# Altium schematic sheet MAIN.SchDoc
size A3; SheetNumber: 1; SheetTotal: 1
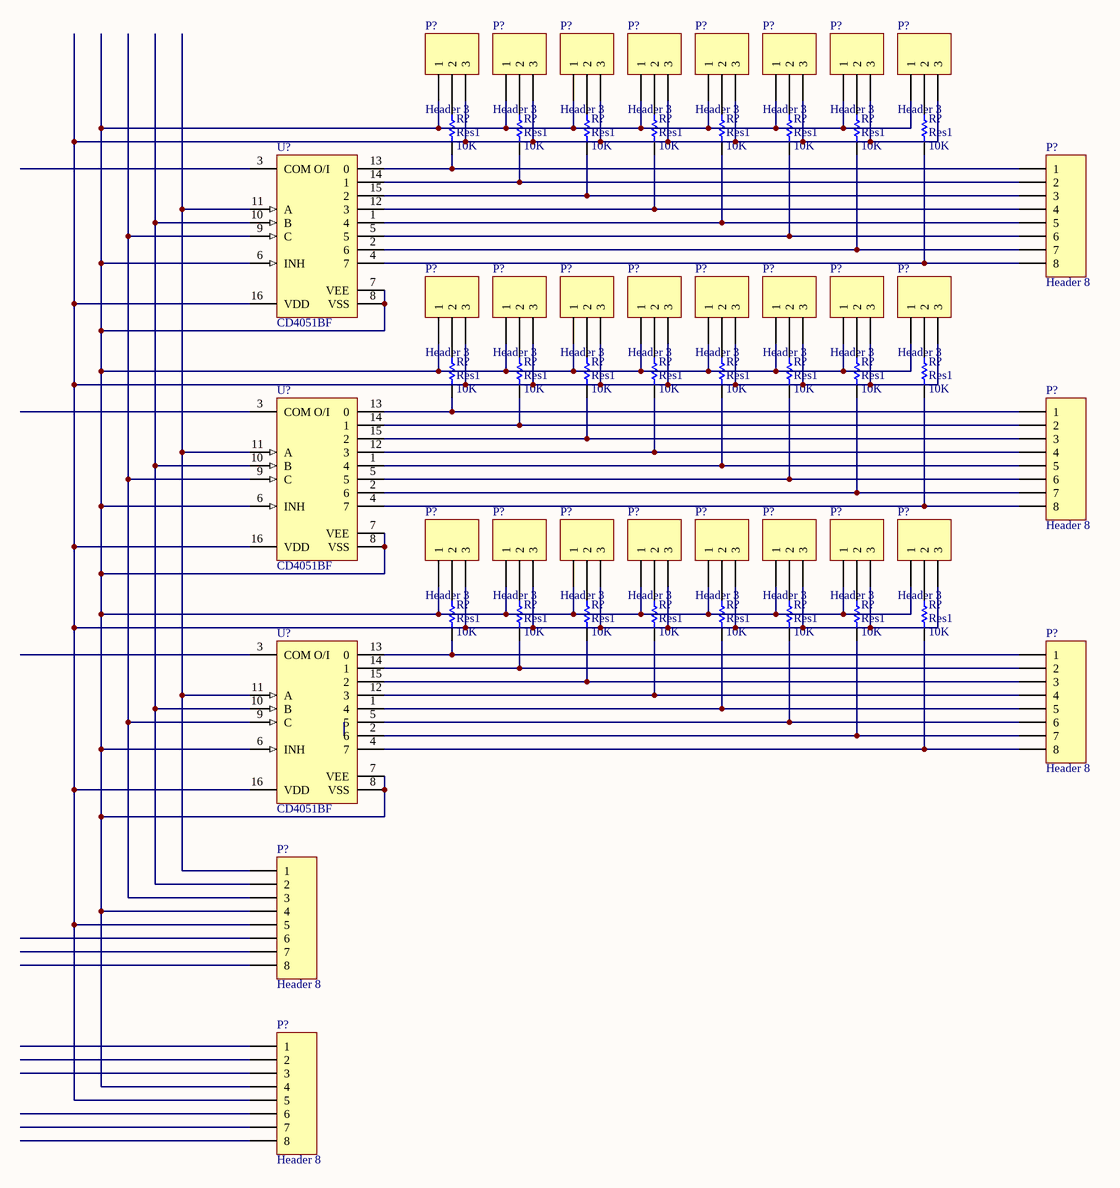
[diagram p0: MAIN.SchDoc]

## Parts
(Parts that share a designator on the sheet are numbered #1, #2 ... from top to bottom, then left to right.)
P?#1  Header 3  [HDR1X3]
P?#2  Header 3  [HDR1X3]
P?#3  Header 3  [HDR1X3]
P?#4  Header 3  [HDR1X3]
P?#5  Header 3  [HDR1X3]
P?#6  Header 3  [HDR1X3]
P?#7  Header 3  [HDR1X3]
P?#8  Header 3  [HDR1X3]
P?#9  Header 8  [HDR1X8]
P?#10  Header 3  [HDR1X3]
P?#11  Header 3  [HDR1X3]
P?#12  Header 3  [HDR1X3]
P?#13  Header 3  [HDR1X3]
P?#14  Header 3  [HDR1X3]
P?#15  Header 3  [HDR1X3]
P?#16  Header 3  [HDR1X3]
P?#17  Header 3  [HDR1X3]
P?#18  Header 8  [HDR1X8]
P?#19  Header 3  [HDR1X3]
P?#20  Header 3  [HDR1X3]
P?#21  Header 3  [HDR1X3]
P?#22  Header 3  [HDR1X3]
P?#23  Header 3  [HDR1X3]
P?#24  Header 3  [HDR1X3]
P?#25  Header 3  [HDR1X3]
P?#26  Header 3  [HDR1X3]
P?#27  Header 8  [HDR1X8]
P?#28  Header 8  [HDR1X8]
P?#29  Header 8  [HDR1X8]
R?#1  Res1  value 10K  [AXIAL-0.3]
R?#2  Res1  value 10K  [AXIAL-0.3]
R?#3  Res1  value 10K  [AXIAL-0.3]
R?#4  Res1  value 10K  [AXIAL-0.3]
R?#5  Res1  value 10K  [AXIAL-0.3]
R?#6  Res1  value 10K  [AXIAL-0.3]
R?#7  Res1  value 10K  [AXIAL-0.3]
R?#8  Res1  value 10K  [AXIAL-0.3]
R?#9  Res1  value 10K  [AXIAL-0.3]
R?#10  Res1  value 10K  [AXIAL-0.3]
R?#11  Res1  value 10K  [AXIAL-0.3]
R?#12  Res1  value 10K  [AXIAL-0.3]
R?#13  Res1  value 10K  [AXIAL-0.3]
R?#14  Res1  value 10K  [AXIAL-0.3]
R?#15  Res1  value 10K  [AXIAL-0.3]
R?#16  Res1  value 10K  [AXIAL-0.3]
R?#17  Res1  value 10K  [AXIAL-0.3]
R?#18  Res1  value 10K  [AXIAL-0.3]
R?#19  Res1  value 10K  [AXIAL-0.3]
R?#20  Res1  value 10K  [AXIAL-0.3]
R?#21  Res1  value 10K  [AXIAL-0.3]
R?#22  Res1  value 10K  [AXIAL-0.3]
R?#23  Res1  value 10K  [AXIAL-0.3]
R?#24  Res1  value 10K  [AXIAL-0.3]
U?#1  CD4051BF  [J0016A]
U?#2  CD4051BF  [J0016A]
U?#3  CD4051BF  [J0016A]

## Nets
NetP?#1_1: P?#1.1 P?#2.1 P?#3.1 P?#4.1 P?#5.1 P?#6.1 P?#7.1 P?#8.1 P?#10.1 P?#11.1 P?#12.1 P?#13.1 P?#14.1 P?#15.1 P?#16.1 P?#17.1 P?#19.1 P?#20.1 P?#21.1 P?#22.1 P?#23.1 P?#24.1 P?#25.1 P?#26.1 P?#28.4 P?#29.4 U?#1.6(INH) U?#1.7(VEE) U?#1.8(VSS) U?#2.6(INH) U?#2.7(VEE) U?#2.8(VSS) U?#3.6(INH) U?#3.7(VEE) U?#3.8(VSS)
NetP?#1_2: P?#1.2 R?#1.2
NetP?#1_3: P?#1.3 P?#2.3 P?#3.3 P?#4.3 P?#5.3 P?#6.3 P?#7.3 P?#8.3 P?#10.3 P?#11.3 P?#12.3 P?#13.3 P?#14.3 P?#15.3 P?#16.3 P?#17.3 P?#19.3 P?#20.3 P?#21.3 P?#22.3 P?#23.3 P?#24.3 P?#25.3 P?#26.3 P?#28.5 P?#29.5 U?#1.16(VDD) U?#2.16(VDD) U?#3.16(VDD)
NetP?#2_2: P?#2.2 R?#2.2
NetP?#3_2: P?#3.2 R?#3.2
NetP?#4_2: P?#4.2 R?#4.2
NetP?#5_2: P?#5.2 R?#5.2
NetP?#6_2: P?#6.2 R?#6.2
NetP?#7_2: P?#7.2 R?#7.2
NetP?#8_2: P?#8.2 R?#8.2
NetP?#9_1: P?#9.1 R?#1.1 U?#1.13(0)
NetP?#9_2: P?#9.2 R?#2.1 U?#1.14(1)
NetP?#9_3: P?#9.3 R?#3.1 U?#1.15(2)
NetP?#9_4: P?#9.4 R?#4.1 U?#1.12(3)
NetP?#9_5: P?#9.5 R?#5.1 U?#1.1(4)
NetP?#9_6: P?#9.6 R?#6.1 U?#1.5
NetP?#9_7: P?#9.7 R?#7.1 U?#1.2(6)
NetP?#9_8: P?#9.8 R?#8.1 U?#1.4(7)
NetP?#10_2: P?#10.2 R?#9.2
NetP?#11_2: P?#11.2 R?#10.2
NetP?#12_2: P?#12.2 R?#11.2
NetP?#13_2: P?#13.2 R?#12.2
NetP?#14_2: P?#14.2 R?#13.2
NetP?#15_2: P?#15.2 R?#14.2
NetP?#16_2: P?#16.2 R?#15.2
NetP?#17_2: P?#17.2 R?#16.2
NetP?#18_1: P?#18.1 R?#9.1 U?#2.13(0)
NetP?#18_2: P?#18.2 R?#10.1 U?#2.14(1)
NetP?#18_3: P?#18.3 R?#11.1 U?#2.15(2)
NetP?#18_4: P?#18.4 R?#12.1 U?#2.12(3)
NetP?#18_5: P?#18.5 R?#13.1 U?#2.1(4)
NetP?#18_6: P?#18.6 R?#14.1 U?#2.5
NetP?#18_7: P?#18.7 R?#15.1 U?#2.2(6)
NetP?#18_8: P?#18.8 R?#16.1 U?#2.4(7)
NetP?#19_2: P?#19.2 R?#17.2
NetP?#20_2: P?#20.2 R?#18.2
NetP?#21_2: P?#21.2 R?#19.2
NetP?#22_2: P?#22.2 R?#20.2
NetP?#23_2: P?#23.2 R?#21.2
NetP?#24_2: P?#24.2 R?#22.2
NetP?#25_2: P?#25.2 R?#23.2
NetP?#26_2: P?#26.2 R?#24.2
NetP?#27_1: P?#27.1 R?#17.1 U?#3.13(0)
NetP?#27_2: P?#27.2 R?#18.1 U?#3.14(1)
NetP?#27_3: P?#27.3 R?#19.1 U?#3.15(2)
NetP?#27_4: P?#27.4 R?#20.1 U?#3.12(3)
NetP?#27_5: P?#27.5 R?#21.1 U?#3.1(4)
NetP?#27_6: P?#27.6 R?#22.1 U?#3.5
NetP?#27_7: P?#27.7 R?#23.1 U?#3.2(6)
NetP?#27_8: P?#27.8 R?#24.1 U?#3.4(7)
NetP?#28_1: P?#28.1 U?#1.11(A) U?#2.11(A) U?#3.11(A)
NetP?#28_2: P?#28.2 U?#1.10(B) U?#2.10(B) U?#3.10(B)
NetP?#28_3: P?#28.3 U?#1.9(C) U?#2.9(C) U?#3.9(C)

Not connected (* = marked no-connect by the designer): P?#28 6 7 8; P?#29 1 2 3 6 7 8; U?#1 3(COM_O/I); U?#2 3(COM_O/I); U?#3 3(COM_O/I)

## Library data of the parts
P?#1-P?#8 P?#10-P?#17 P?#19-P?#26 = Header 3: Header, 3-Pin; LatestRevisionDate: 17-Jul-2002; LatestRevisionNote: Re-released for DXP Platform.; Publisher: Altium Limited
P?#9 P?#18 P?#27-P?#29 = Header 8: Header, 8-Pin; LatestRevisionDate: 17-Jul-2002; LatestRevisionNote: Re-released for DXP Platform.; Publisher: Altium Limited
R?#1-R?#24 = Res1: Resistor; Published: 8-Jun-2000; LatestRevisionDate: 17-Jul-2002; LatestRevisionNote: Re-released for DXP Platform.; PackageReference: AXIAL-0.3; Publisher: Altium Limited; PackageDescription: Axial Device, Thru-Hole; 2 Leads; 0.3 in Pin Spacing
U?#1-U?#3 = CMP-1575-00057-4: CMOS Single 8-Channel Analog Multiplexer/Demultiplexer with Logic-Level Conversion, J0016A, TUBE; Generic Part Number: CD4051B-MIL; Manufacturer: Texas Instruments; VCC(Max)(V): 18; VCC(Min)(V): 5; Crosstalk: Yes; ICC(Typ)(mA): 0.00008; Bandwidth(Max)(MHz): 20; Ron(Typ)(Ohms): 125; Rating: Military; Ron(Max)(Ohms): 240; Configuration: 1 X 1：8 MUX; PackageReference: J0016A; PackageVersion: http://www.ti.com/lit/ml/mcer002d/mcer002d.pdf; Operating Temperature Range(C): -55 to 125; DatasheetVersion: SCHS047G